# Altium schematic sheet DCDC3.SchDoc: Buck 3.5V
size 292 x 193 mm; CheckedBy: Jakub Howors; Author: Łukasz Gójski; CompanyName: Politechnika Warszawska; Organization: EITI; Address1: Nowowiejska 15/19; Address2: 00-665 Warszawa; SheetNumber: 5; SheetTotal: 13; HTTPLink: www.pw.edu.pl
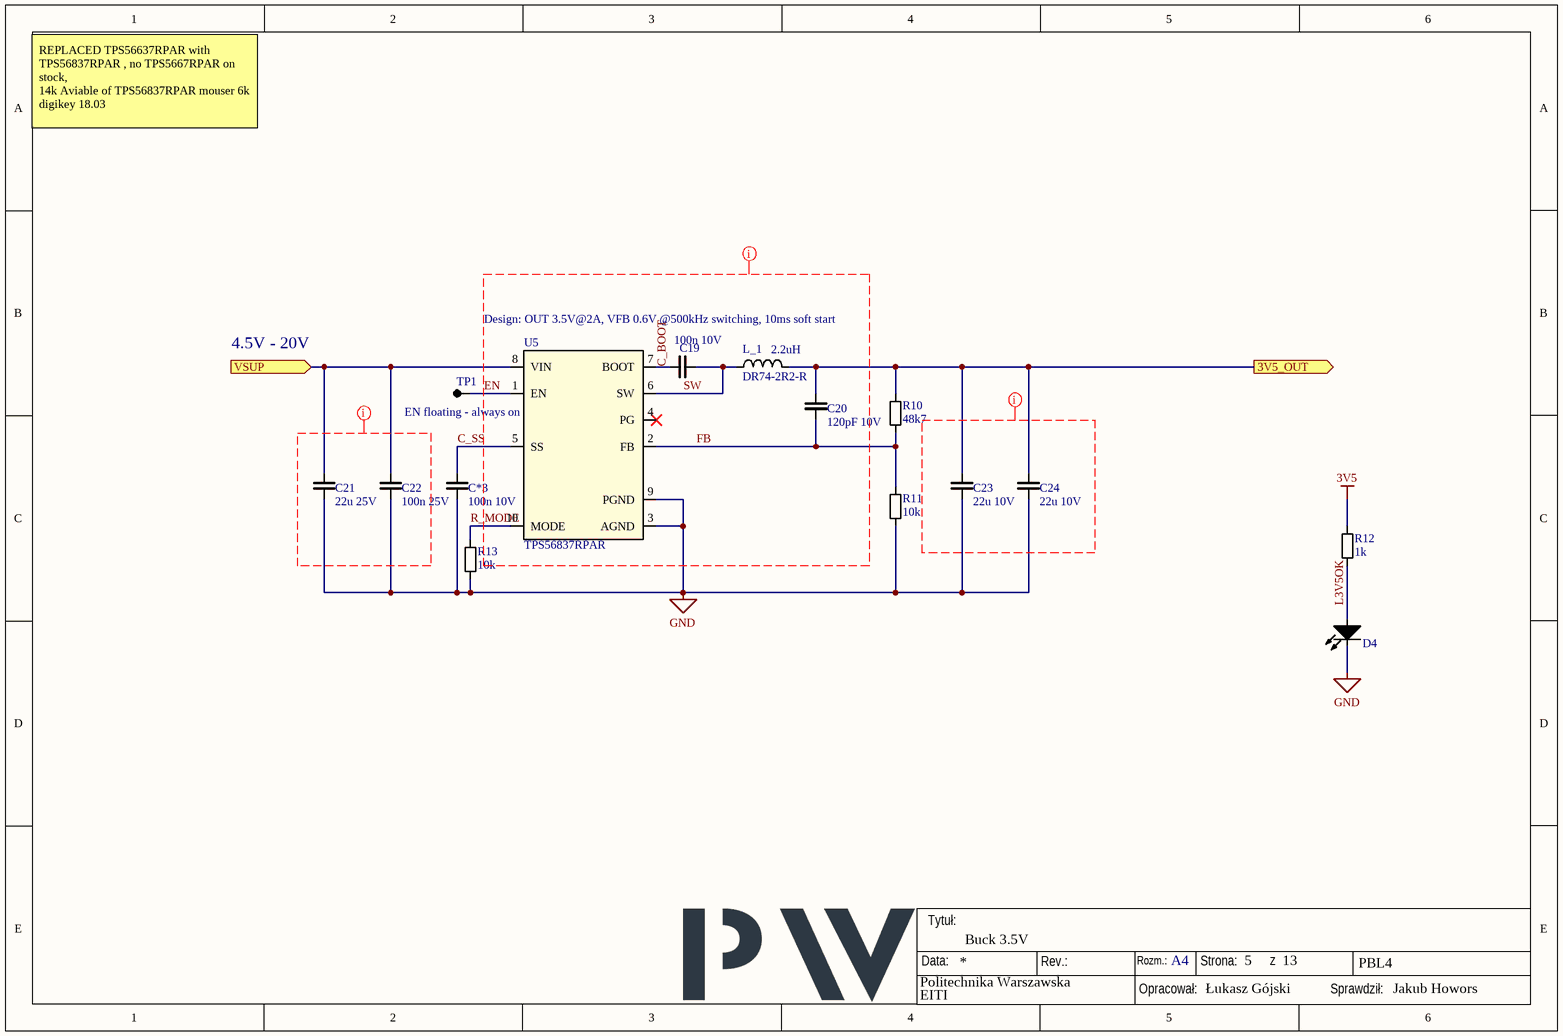
[diagram p0: DCDC3.SchDoc]

## Parts
C19  100n 10V  [C_0603]
C20  120pF 10V  [C_0603]
C21  22u 25V  [C_1206]
C22  100n 25V  [C_0603]
C23  22u 10V  [C_1206]
C24  22u 10V  [C_1206]
C*3  100n 10V  [C_0603]
D4  RED  [LED_0603]  (value not drawn)
L_1  DR74-2R2-R  [DR74-2R2-R]
R10  48k7  [R_0603]
R11  10k  [R_0603]
R12  1k  [R_0603]
R13  10k  [R_0603]
TP1  TP  [TP]  (value not drawn)
U5  TPS56837RPAR  [RPA0010A-MFG]

## Ports
3V5_OUT (out, see PowerAssembly[6A]), VSUP (in, see PowerAssembly[5A])

## Nets
3V5: R12.2
GND: C21.1 C22.1 C23.1 C24.1 C*3.1 D4.K R11.1 R13.1 U5.3(AGND) U5.9(PGND)
3V5_OUT: C20.2 C23.2 C24.2 L_1.2 R10.2 ; port 3V5_OUT
C_BOOT: C19.2 U5.7(BOOT)
C_SS: C*3.2 U5.5(SS)
EN: TP1.1(TP) U5.1(EN)
FB: C20.1 R10.1 R11.2 U5.2(FB)
L3V5OK: D4.A R12.1
R_MODE: R13.2 U5.10(MODE)
SW: C19.1 L_1.1 U5.6(SW)
VSUP: C21.2 C22.2 U5.8(VIN) ; port VSUP

Not connected (* = marked no-connect by the designer): U5 4(PG)*

## Layout directives
CompClassName: NoRelief: (no net found under the mark), C_BOOT, EN, FB, SW

## Notes on the sheet
- REPLACED TPS56637RPAR with TPS56837RPAR , no TPS5667RPAR on stock,
  14k Aviable of TPS56837RPAR mouser 6k digikey 18.03
- 4.5V - 20V
- Design: OUT 3.5V@2A, VFB 0.6V @500kHz switching, 10ms soft start
- (near L_1) 2.2uH
- (near U5) EN floating - always on
- Data:
- Tytuł:
- Rev.:
- Rozm.:
- A4
- Strona:
- z
- PBL4
- Opracował:
- Sprawdził:

## Library data of the parts
C19 C*3 = C_100nF_10V: Ceramic capacitor; Casing: 0603; Dielectric: X7R; Tolerance: 10%; Value: 100n; Voltage: 10V; Technology: Ceramic
C20 = C_120pF_10V: Ceramic capacitor; Value: 120p; Casing: 0603; Dielectric: XR7; Tolerance: 10%; Voltage: 10V; Technology: Ceramic
C21 = C_22uF_25V: Ceramic capacitor; Casing: 1206; Dielectric: X7R; Tolerance: 20%; Value: 22u; Voltage: 25V; Technology: Ceramic
C22 = C_100nF_25V: Ceramic capacitor; Casing: 0603; Dielectric: X7R; Tolerance: 10%; Value: 100n; Voltage: 25V; Technology: Ceramic
C23 C24 = C_22uF_10V: Ceramic capacitor; Casing: 1206; Dielectric: X5R; Tolerance: 20%; Value: 22u; Voltage: 10V; Technology: Ceramic
D4 = LED_0603: LED RED 0603 3.3V; Casing: 0603; Color: RED
L_1 = L_2u2_4.76A_1: Inductor, 2.2uF 4.76A; Manufacturer: EATON ELECTRONICS; Value: 2u2; Tolerance: 20%; IDC: 7.06A; ComponentLink1Description: Datasheet; ComponentLink1URL: https://www.eaton.com/content/dam/eaton/products/electronic-components/resources/data-sheet/eaton-dr-high-power-density-high-efficiency-shielded-drum-core-power-inductors-data-sheet.pdf; ComponentLink2Description: Supplier; ComponentLink2URL: https://www.digikey.pl/pl/products/detail/eaton-electronics-division/DR74-2R2-R/667219
R10 = R_48k7: Resistor; Tolerance: 1%; Power: 100mW; Casing: 0603; Value: 48k7
R11 R13 = R_10k: Resistor; Tolerance: 1%; Power: 100mW; Casing: 0603; Value: 10k
R12 = R_1k: Resistor; Tolerance: 1%; Power: 100mW; Casing: 0603; Value: 1k
U5 = TPS56837RPAR: Switching Voltage Regulators 4.5-V to 28-V input 8-A synchronous buck; Manufacturer: Texas Instruments; Manufacturer_Part_Number: TPS56837RPAR